# EasyEDA schematic LED SCHEMATIC.json

## Sheets
1 按键矩阵64: TITLE: 按键矩阵64; REV: 1.0; Date: 2023-08-13; Sheet: 1/1; Drawn By: daifresne; Company: Your Company
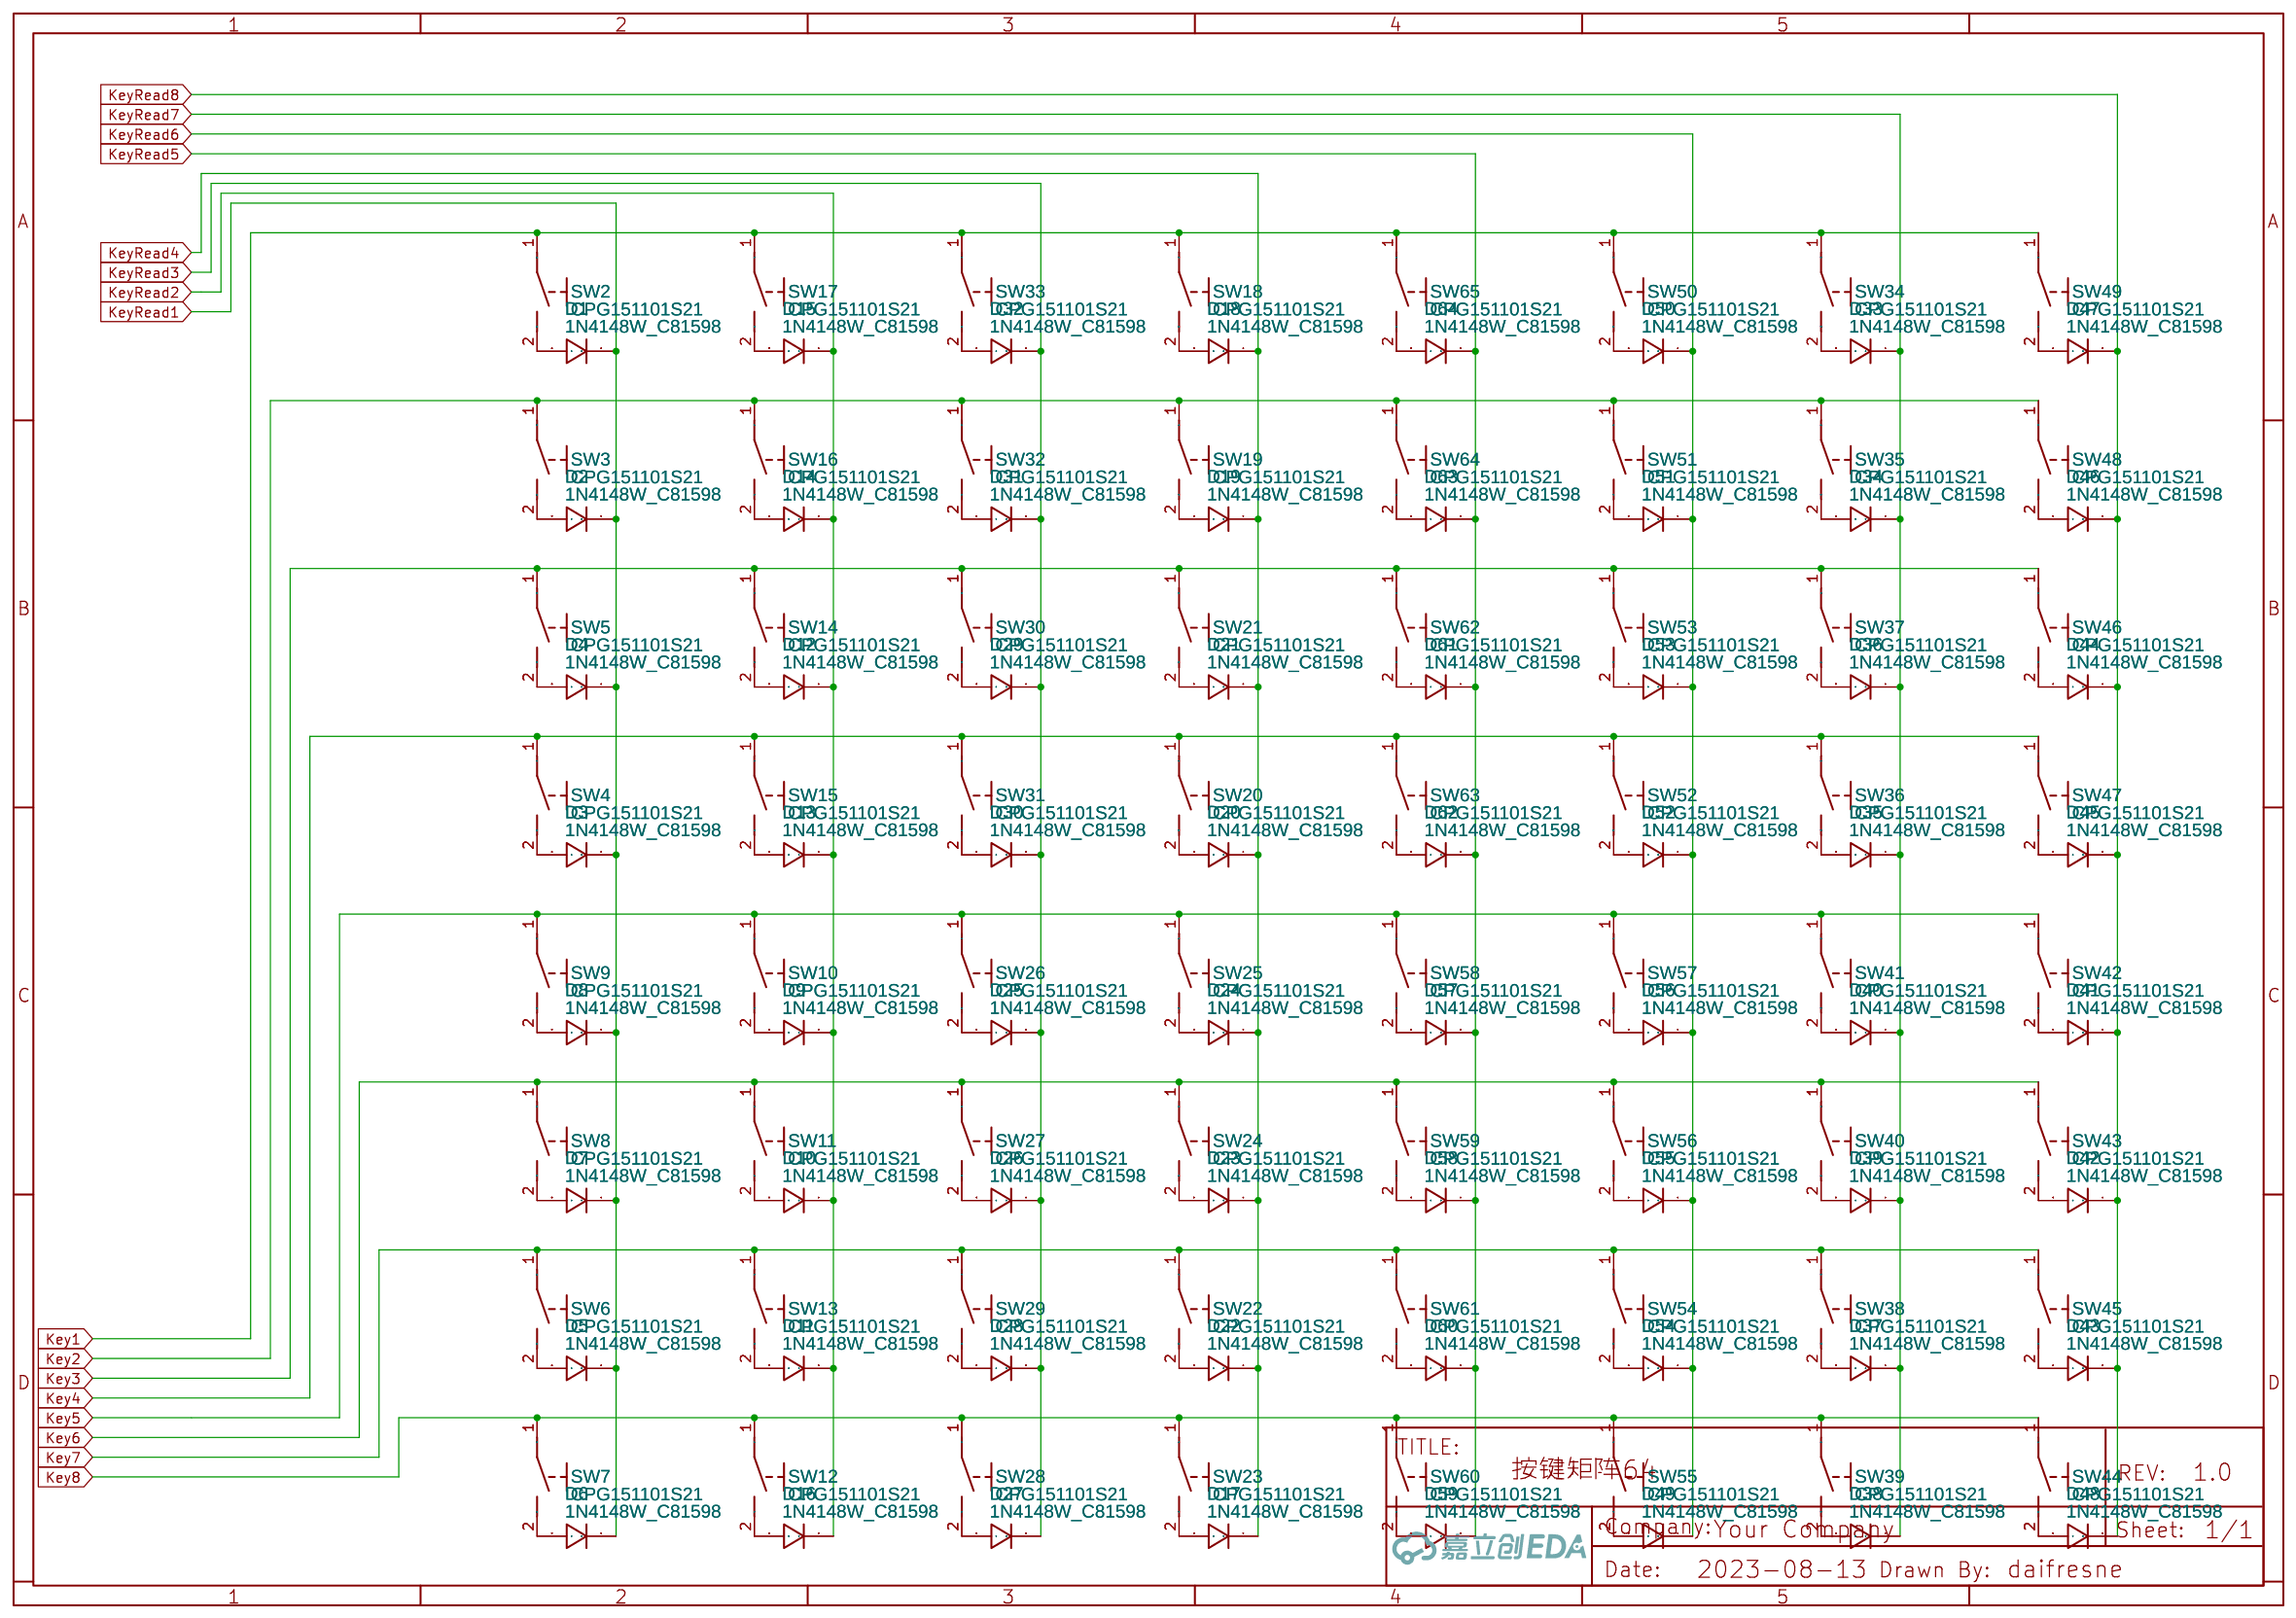
[diagram p0: 按键矩阵64]
2 LED矩阵64: TITLE: LED矩阵64
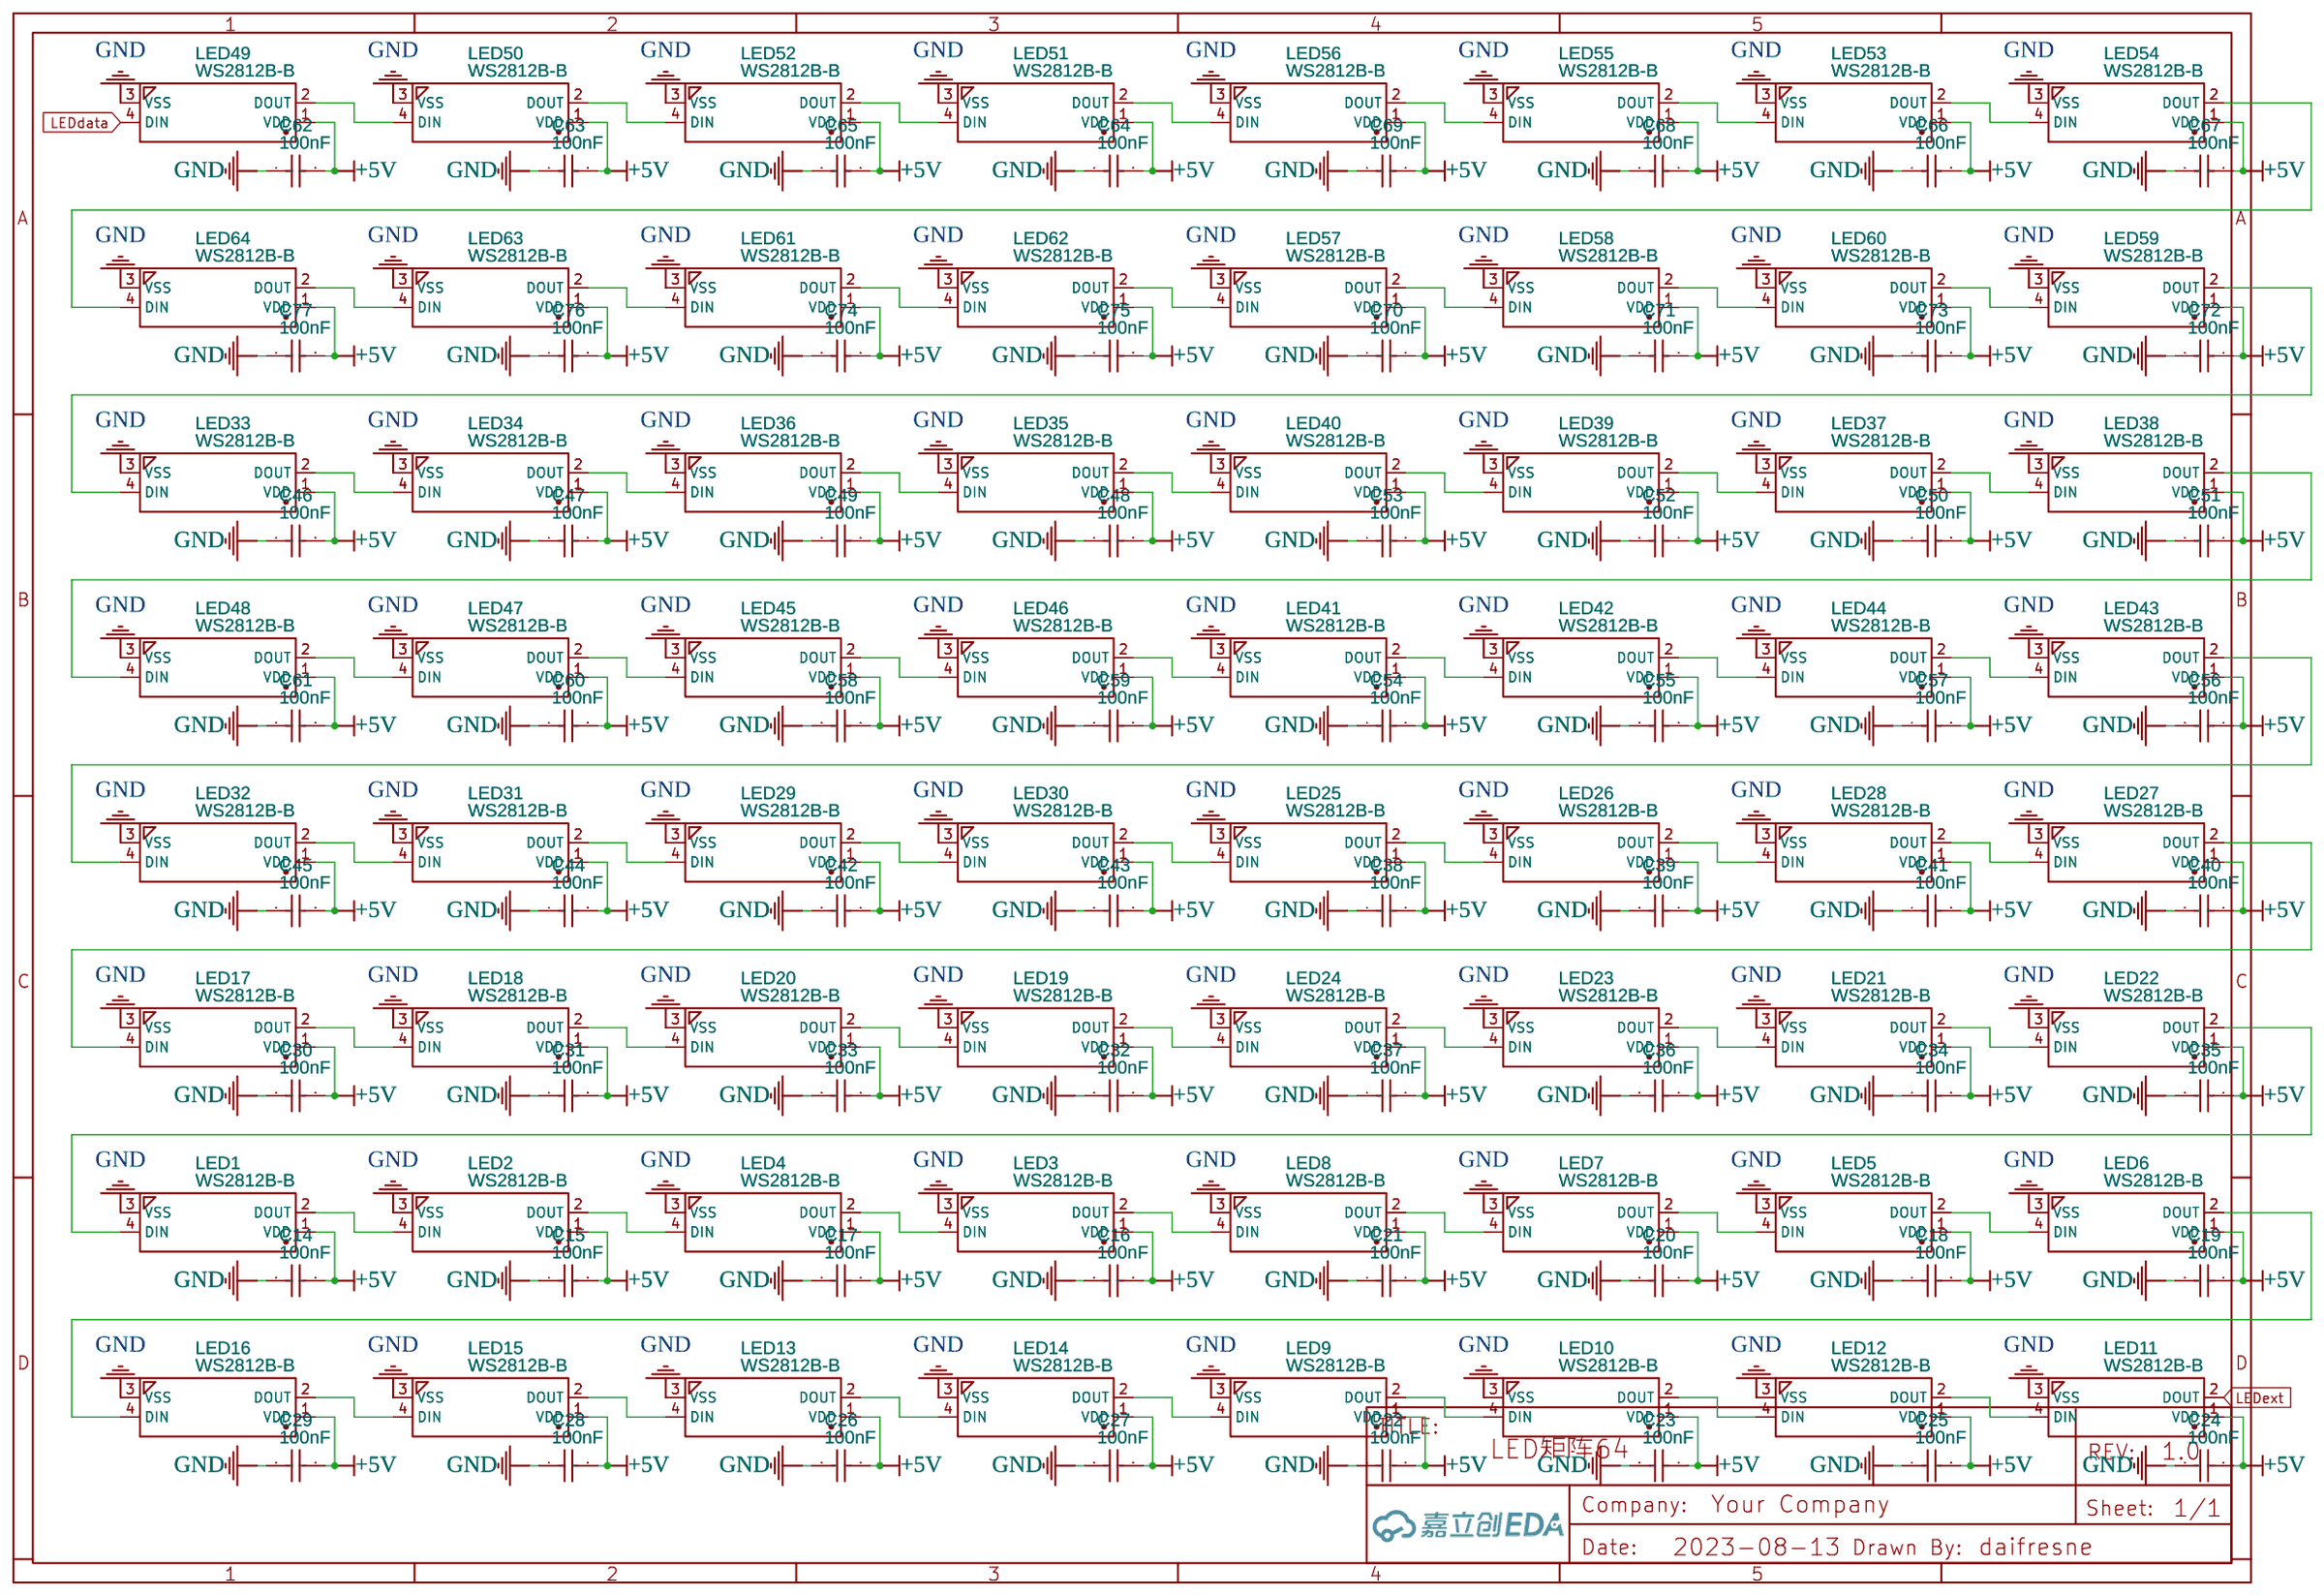
[diagram p1: LED矩阵64]

## Parts
sheet LED矩阵64
C14  100nF  [C0603]
C15  100nF  [C0603]
C16  100nF  [C0603]
C17  100nF  [C0603]
C18  100nF  [C0603]
C19  100nF  [C0603]
C20  100nF  [C0603]
C21  100nF  [C0603]
C22  100nF  [C0603]
C23  100nF  [C0603]
C24  100nF  [C0603]
C25  100nF  [C0603]
C26  100nF  [C0603]
C27  100nF  [C0603]
C28  100nF  [C0603]
C29  100nF  [C0603]
C30  100nF  [C0603]
C31  100nF  [C0603]
C32  100nF  [C0603]
C33  100nF  [C0603]
C34  100nF  [C0603]
C35  100nF  [C0603]
C36  100nF  [C0603]
C37  100nF  [C0603]
C38  100nF  [C0603]
C39  100nF  [C0603]
C40  100nF  [C0603]
C41  100nF  [C0603]
C42  100nF  [C0603]
C43  100nF  [C0603]
C44  100nF  [C0603]
C45  100nF  [C0603]
C46  100nF  [C0603]
C47  100nF  [C0603]
C48  100nF  [C0603]
C49  100nF  [C0603]
C50  100nF  [C0603]
C51  100nF  [C0603]
C52  100nF  [C0603]
C53  100nF  [C0603]
C54  100nF  [C0603]
C55  100nF  [C0603]
C56  100nF  [C0603]
C57  100nF  [C0603]
C58  100nF  [C0603]
C59  100nF  [C0603]
C60  100nF  [C0603]
C61  100nF  [C0603]
C62  100nF  [C0603]
C63  100nF  [C0603]
C64  100nF  [C0603]
C65  100nF  [C0603]
C66  100nF  [C0603]
C67  100nF  [C0603]
C68  100nF  [C0603]
C69  100nF  [C0603]
C70  100nF  [C0603]
C71  100nF  [C0603]
C72  100nF  [C0603]
C73  100nF  [C0603]
C74  100nF  [C0603]
C75  100nF  [C0603]
C76  100nF  [C0603]
C77  100nF  [C0603]
LED1  WS2812B-B  [LED-SMD_4P-L5.0-W5.0-BL_TC5050RGB]
LED2  WS2812B-B  [LED-SMD_4P-L5.0-W5.0-BL_TC5050RGB]
LED3  WS2812B-B  [LED-SMD_4P-L5.0-W5.0-BL_TC5050RGB]
LED4  WS2812B-B  [LED-SMD_4P-L5.0-W5.0-BL_TC5050RGB]
LED5  WS2812B-B  [LED-SMD_4P-L5.0-W5.0-BL_TC5050RGB]
LED6  WS2812B-B  [LED-SMD_4P-L5.0-W5.0-BL_TC5050RGB]
LED7  WS2812B-B  [LED-SMD_4P-L5.0-W5.0-BL_TC5050RGB]
LED8  WS2812B-B  [LED-SMD_4P-L5.0-W5.0-BL_TC5050RGB]
LED9  WS2812B-B  [LED-SMD_4P-L5.0-W5.0-BL_TC5050RGB]
LED10  WS2812B-B  [LED-SMD_4P-L5.0-W5.0-BL_TC5050RGB]
LED11  WS2812B-B  [LED-SMD_4P-L5.0-W5.0-BL_TC5050RGB]
LED12  WS2812B-B  [LED-SMD_4P-L5.0-W5.0-BL_TC5050RGB]
LED13  WS2812B-B  [LED-SMD_4P-L5.0-W5.0-BL_TC5050RGB]
LED14  WS2812B-B  [LED-SMD_4P-L5.0-W5.0-BL_TC5050RGB]
LED15  WS2812B-B  [LED-SMD_4P-L5.0-W5.0-BL_TC5050RGB]
LED16  WS2812B-B  [LED-SMD_4P-L5.0-W5.0-BL_TC5050RGB]
LED17  WS2812B-B  [LED-SMD_4P-L5.0-W5.0-BL_TC5050RGB]
LED18  WS2812B-B  [LED-SMD_4P-L5.0-W5.0-BL_TC5050RGB]
LED19  WS2812B-B  [LED-SMD_4P-L5.0-W5.0-BL_TC5050RGB]
LED20  WS2812B-B  [LED-SMD_4P-L5.0-W5.0-BL_TC5050RGB]
LED21  WS2812B-B  [LED-SMD_4P-L5.0-W5.0-BL_TC5050RGB]
LED22  WS2812B-B  [LED-SMD_4P-L5.0-W5.0-BL_TC5050RGB]
LED23  WS2812B-B  [LED-SMD_4P-L5.0-W5.0-BL_TC5050RGB]
LED24  WS2812B-B  [LED-SMD_4P-L5.0-W5.0-BL_TC5050RGB]
LED25  WS2812B-B  [LED-SMD_4P-L5.0-W5.0-BL_TC5050RGB]
LED26  WS2812B-B  [LED-SMD_4P-L5.0-W5.0-BL_TC5050RGB]
LED27  WS2812B-B  [LED-SMD_4P-L5.0-W5.0-BL_TC5050RGB]
LED28  WS2812B-B  [LED-SMD_4P-L5.0-W5.0-BL_TC5050RGB]
LED29  WS2812B-B  [LED-SMD_4P-L5.0-W5.0-BL_TC5050RGB]
LED30  WS2812B-B  [LED-SMD_4P-L5.0-W5.0-BL_TC5050RGB]
LED31  WS2812B-B  [LED-SMD_4P-L5.0-W5.0-BL_TC5050RGB]
LED32  WS2812B-B  [LED-SMD_4P-L5.0-W5.0-BL_TC5050RGB]
LED33  WS2812B-B  [LED-SMD_4P-L5.0-W5.0-BL_TC5050RGB]
LED34  WS2812B-B  [LED-SMD_4P-L5.0-W5.0-BL_TC5050RGB]
LED35  WS2812B-B  [LED-SMD_4P-L5.0-W5.0-BL_TC5050RGB]
LED36  WS2812B-B  [LED-SMD_4P-L5.0-W5.0-BL_TC5050RGB]
LED37  WS2812B-B  [LED-SMD_4P-L5.0-W5.0-BL_TC5050RGB]
LED38  WS2812B-B  [LED-SMD_4P-L5.0-W5.0-BL_TC5050RGB]
LED39  WS2812B-B  [LED-SMD_4P-L5.0-W5.0-BL_TC5050RGB]
LED40  WS2812B-B  [LED-SMD_4P-L5.0-W5.0-BL_TC5050RGB]
LED41  WS2812B-B  [LED-SMD_4P-L5.0-W5.0-BL_TC5050RGB]
LED42  WS2812B-B  [LED-SMD_4P-L5.0-W5.0-BL_TC5050RGB]
LED43  WS2812B-B  [LED-SMD_4P-L5.0-W5.0-BL_TC5050RGB]
LED44  WS2812B-B  [LED-SMD_4P-L5.0-W5.0-BL_TC5050RGB]
LED45  WS2812B-B  [LED-SMD_4P-L5.0-W5.0-BL_TC5050RGB]
LED46  WS2812B-B  [LED-SMD_4P-L5.0-W5.0-BL_TC5050RGB]
LED47  WS2812B-B  [LED-SMD_4P-L5.0-W5.0-BL_TC5050RGB]
LED48  WS2812B-B  [LED-SMD_4P-L5.0-W5.0-BL_TC5050RGB]
LED49  WS2812B-B  [LED-SMD_4P-L5.0-W5.0-BL_TC5050RGB]
LED50  WS2812B-B  [LED-SMD_4P-L5.0-W5.0-BL_TC5050RGB]
LED51  WS2812B-B  [LED-SMD_4P-L5.0-W5.0-BL_TC5050RGB]
LED52  WS2812B-B  [LED-SMD_4P-L5.0-W5.0-BL_TC5050RGB]
LED53  WS2812B-B  [LED-SMD_4P-L5.0-W5.0-BL_TC5050RGB]
LED54  WS2812B-B  [LED-SMD_4P-L5.0-W5.0-BL_TC5050RGB]
LED55  WS2812B-B  [LED-SMD_4P-L5.0-W5.0-BL_TC5050RGB]
LED56  WS2812B-B  [LED-SMD_4P-L5.0-W5.0-BL_TC5050RGB]
LED57  WS2812B-B  [LED-SMD_4P-L5.0-W5.0-BL_TC5050RGB]
LED58  WS2812B-B  [LED-SMD_4P-L5.0-W5.0-BL_TC5050RGB]
LED59  WS2812B-B  [LED-SMD_4P-L5.0-W5.0-BL_TC5050RGB]
LED60  WS2812B-B  [LED-SMD_4P-L5.0-W5.0-BL_TC5050RGB]
LED61  WS2812B-B  [LED-SMD_4P-L5.0-W5.0-BL_TC5050RGB]
LED62  WS2812B-B  [LED-SMD_4P-L5.0-W5.0-BL_TC5050RGB]
LED63  WS2812B-B  [LED-SMD_4P-L5.0-W5.0-BL_TC5050RGB]
LED64  WS2812B-B  [LED-SMD_4P-L5.0-W5.0-BL_TC5050RGB]
sheet 按键矩阵64
D1  1N4148W_C81598  [SOD-123F_L2.7-W1.6-LS3.8-RD]
D2  1N4148W_C81598  [SOD-123F_L2.7-W1.6-LS3.8-RD]
D3  1N4148W_C81598  [SOD-123F_L2.7-W1.6-LS3.8-RD]
D4  1N4148W_C81598  [SOD-123F_L2.7-W1.6-LS3.8-RD]
D5  1N4148W_C81598  [SOD-123F_L2.7-W1.6-LS3.8-RD]
D6  1N4148W_C81598  [SOD-123F_L2.7-W1.6-LS3.8-RD]
D7  1N4148W_C81598  [SOD-123F_L2.7-W1.6-LS3.8-RD]
D8  1N4148W_C81598  [SOD-123F_L2.7-W1.6-LS3.8-RD]
D9  1N4148W_C81598  [SOD-123F_L2.7-W1.6-LS3.8-RD]
D10  1N4148W_C81598  [SOD-123F_L2.7-W1.6-LS3.8-RD]
D11  1N4148W_C81598  [SOD-123F_L2.7-W1.6-LS3.8-RD]
D12  1N4148W_C81598  [SOD-123F_L2.7-W1.6-LS3.8-RD]
D13  1N4148W_C81598  [SOD-123F_L2.7-W1.6-LS3.8-RD]
D14  1N4148W_C81598  [SOD-123F_L2.7-W1.6-LS3.8-RD]
D15  1N4148W_C81598  [SOD-123F_L2.7-W1.6-LS3.8-RD]
D16  1N4148W_C81598  [SOD-123F_L2.7-W1.6-LS3.8-RD]
D17  1N4148W_C81598  [SOD-123F_L2.7-W1.6-LS3.8-RD]
D18  1N4148W_C81598  [SOD-123F_L2.7-W1.6-LS3.8-RD]
D19  1N4148W_C81598  [SOD-123F_L2.7-W1.6-LS3.8-RD]
D20  1N4148W_C81598  [SOD-123F_L2.7-W1.6-LS3.8-RD]
D21  1N4148W_C81598  [SOD-123F_L2.7-W1.6-LS3.8-RD]
D22  1N4148W_C81598  [SOD-123F_L2.7-W1.6-LS3.8-RD]
D23  1N4148W_C81598  [SOD-123F_L2.7-W1.6-LS3.8-RD]
D24  1N4148W_C81598  [SOD-123F_L2.7-W1.6-LS3.8-RD]
D25  1N4148W_C81598  [SOD-123F_L2.7-W1.6-LS3.8-RD]
D26  1N4148W_C81598  [SOD-123F_L2.7-W1.6-LS3.8-RD]
D27  1N4148W_C81598  [SOD-123F_L2.7-W1.6-LS3.8-RD]
D28  1N4148W_C81598  [SOD-123F_L2.7-W1.6-LS3.8-RD]
D29  1N4148W_C81598  [SOD-123F_L2.7-W1.6-LS3.8-RD]
D30  1N4148W_C81598  [SOD-123F_L2.7-W1.6-LS3.8-RD]
D31  1N4148W_C81598  [SOD-123F_L2.7-W1.6-LS3.8-RD]
D32  1N4148W_C81598  [SOD-123F_L2.7-W1.6-LS3.8-RD]
D33  1N4148W_C81598  [SOD-123F_L2.7-W1.6-LS3.8-RD]
D34  1N4148W_C81598  [SOD-123F_L2.7-W1.6-LS3.8-RD]
D35  1N4148W_C81598  [SOD-123F_L2.7-W1.6-LS3.8-RD]
D36  1N4148W_C81598  [SOD-123F_L2.7-W1.6-LS3.8-RD]
D37  1N4148W_C81598  [SOD-123F_L2.7-W1.6-LS3.8-RD]
D38  1N4148W_C81598  [SOD-123F_L2.7-W1.6-LS3.8-RD]
D39  1N4148W_C81598  [SOD-123F_L2.7-W1.6-LS3.8-RD]
D40  1N4148W_C81598  [SOD-123F_L2.7-W1.6-LS3.8-RD]
D41  1N4148W_C81598  [SOD-123F_L2.7-W1.6-LS3.8-RD]
D42  1N4148W_C81598  [SOD-123F_L2.7-W1.6-LS3.8-RD]
D43  1N4148W_C81598  [SOD-123F_L2.7-W1.6-LS3.8-RD]
D44  1N4148W_C81598  [SOD-123F_L2.7-W1.6-LS3.8-RD]
D45  1N4148W_C81598  [SOD-123F_L2.7-W1.6-LS3.8-RD]
D46  1N4148W_C81598  [SOD-123F_L2.7-W1.6-LS3.8-RD]
D47  1N4148W_C81598  [SOD-123F_L2.7-W1.6-LS3.8-RD]
D48  1N4148W_C81598  [SOD-123F_L2.7-W1.6-LS3.8-RD]
D49  1N4148W_C81598  [SOD-123F_L2.7-W1.6-LS3.8-RD]
D50  1N4148W_C81598  [SOD-123F_L2.7-W1.6-LS3.8-RD]
D51  1N4148W_C81598  [SOD-123F_L2.7-W1.6-LS3.8-RD]
D52  1N4148W_C81598  [SOD-123F_L2.7-W1.6-LS3.8-RD]
D53  1N4148W_C81598  [SOD-123F_L2.7-W1.6-LS3.8-RD]
D54  1N4148W_C81598  [SOD-123F_L2.7-W1.6-LS3.8-RD]
D55  1N4148W_C81598  [SOD-123F_L2.7-W1.6-LS3.8-RD]
D56  1N4148W_C81598  [SOD-123F_L2.7-W1.6-LS3.8-RD]
D57  1N4148W_C81598  [SOD-123F_L2.7-W1.6-LS3.8-RD]
D58  1N4148W_C81598  [SOD-123F_L2.7-W1.6-LS3.8-RD]
D59  1N4148W_C81598  [SOD-123F_L2.7-W1.6-LS3.8-RD]
D60  1N4148W_C81598  [SOD-123F_L2.7-W1.6-LS3.8-RD]
D61  1N4148W_C81598  [SOD-123F_L2.7-W1.6-LS3.8-RD]
D62  1N4148W_C81598  [SOD-123F_L2.7-W1.6-LS3.8-RD]
D63  1N4148W_C81598  [SOD-123F_L2.7-W1.6-LS3.8-RD]
D64  1N4148W_C81598  [SOD-123F_L2.7-W1.6-LS3.8-RD]
SW2  CPG151101S21  [KEY-TH_CPG1511F01S0X]
SW3  CPG151101S21  [KEY-TH_CPG1511F01S0X]
SW4  CPG151101S21  [KEY-TH_CPG1511F01S0X]
SW5  CPG151101S21  [KEY-TH_CPG1511F01S0X]
SW6  CPG151101S21  [KEY-TH_CPG1511F01S0X]
SW7  CPG151101S21  [KEY-TH_CPG1511F01S0X]
SW8  CPG151101S21  [KEY-TH_CPG1511F01S0X]
SW9  CPG151101S21  [KEY-TH_CPG1511F01S0X]
SW10  CPG151101S21  [KEY-TH_CPG1511F01S0X]
SW11  CPG151101S21  [KEY-TH_CPG1511F01S0X]
SW12  CPG151101S21  [KEY-TH_CPG1511F01S0X]
SW13  CPG151101S21  [KEY-TH_CPG1511F01S0X]
SW14  CPG151101S21  [KEY-TH_CPG1511F01S0X]
SW15  CPG151101S21  [KEY-TH_CPG1511F01S0X]
SW16  CPG151101S21  [KEY-TH_CPG1511F01S0X]
SW17  CPG151101S21  [KEY-TH_CPG1511F01S0X]
SW18  CPG151101S21  [KEY-TH_CPG1511F01S0X]
SW19  CPG151101S21  [KEY-TH_CPG1511F01S0X]
SW20  CPG151101S21  [KEY-TH_CPG1511F01S0X]
SW21  CPG151101S21  [KEY-TH_CPG1511F01S0X]
SW22  CPG151101S21  [KEY-TH_CPG1511F01S0X]
SW23  CPG151101S21  [KEY-TH_CPG1511F01S0X]
SW24  CPG151101S21  [KEY-TH_CPG1511F01S0X]
SW25  CPG151101S21  [KEY-TH_CPG1511F01S0X]
SW26  CPG151101S21  [KEY-TH_CPG1511F01S0X]
SW27  CPG151101S21  [KEY-TH_CPG1511F01S0X]
SW28  CPG151101S21  [KEY-TH_CPG1511F01S0X]
SW29  CPG151101S21  [KEY-TH_CPG1511F01S0X]
SW30  CPG151101S21  [KEY-TH_CPG1511F01S0X]
SW31  CPG151101S21  [KEY-TH_CPG1511F01S0X]
SW32  CPG151101S21  [KEY-TH_CPG1511F01S0X]
SW33  CPG151101S21  [KEY-TH_CPG1511F01S0X]
SW34  CPG151101S21  [KEY-TH_CPG1511F01S0X]
SW35  CPG151101S21  [KEY-TH_CPG1511F01S0X]
SW36  CPG151101S21  [KEY-TH_CPG1511F01S0X]
SW37  CPG151101S21  [KEY-TH_CPG1511F01S0X]
SW38  CPG151101S21  [KEY-TH_CPG1511F01S0X]
SW39  CPG151101S21  [KEY-TH_CPG1511F01S0X]
SW40  CPG151101S21  [KEY-TH_CPG1511F01S0X]
SW41  CPG151101S21  [KEY-TH_CPG1511F01S0X]
SW42  CPG151101S21  [KEY-TH_CPG1511F01S0X]
SW43  CPG151101S21  [KEY-TH_CPG1511F01S0X]
SW44  CPG151101S21  [KEY-TH_CPG1511F01S0X]
SW45  CPG151101S21  [KEY-TH_CPG1511F01S0X]
SW46  CPG151101S21  [KEY-TH_CPG1511F01S0X]
SW47  CPG151101S21  [KEY-TH_CPG1511F01S0X]
SW48  CPG151101S21  [KEY-TH_CPG1511F01S0X]
SW49  CPG151101S21  [KEY-TH_CPG1511F01S0X]
SW50  CPG151101S21  [KEY-TH_CPG1511F01S0X]
SW51  CPG151101S21  [KEY-TH_CPG1511F01S0X]
SW52  CPG151101S21  [KEY-TH_CPG1511F01S0X]
SW53  CPG151101S21  [KEY-TH_CPG1511F01S0X]
SW54  CPG151101S21  [KEY-TH_CPG1511F01S0X]
SW55  CPG151101S21  [KEY-TH_CPG1511F01S0X]
SW56  CPG151101S21  [KEY-TH_CPG1511F01S0X]
SW57  CPG151101S21  [KEY-TH_CPG1511F01S0X]
SW58  CPG151101S21  [KEY-TH_CPG1511F01S0X]
SW59  CPG151101S21  [KEY-TH_CPG1511F01S0X]
SW60  CPG151101S21  [KEY-TH_CPG1511F01S0X]
SW61  CPG151101S21  [KEY-TH_CPG1511F01S0X]
SW62  CPG151101S21  [KEY-TH_CPG1511F01S0X]
SW63  CPG151101S21  [KEY-TH_CPG1511F01S0X]
SW64  CPG151101S21  [KEY-TH_CPG1511F01S0X]
SW65  CPG151101S21  [KEY-TH_CPG1511F01S0X]

## Library data of the parts
C14-C77 = CC0603KRX7R8BB104: Supplier: LCSC; Manufacturer: YAGEO(国巨); Supplier Part: C92490; JLCPCB Part Class: Extended Part
LED1-LED64 = WS2812B-B: Contributor: LCSC; Supplier: LCSC; Manufacturer: worldsemi; Supplier Part: C114586; JLCPCB Part Class: Extended Part
D1-D64 = 1N4148W_C81598: Supplier: LCSC; Manufacturer: ST(先科); Supplier Part: C81598; JLCPCB Part Class: Basic Part
SW2-SW65 = CPG151101S21: Contributor: LCSC; Supplier: LCSC; Supplier Part: C404351; Manufacturer: Kailh(凯华); JLCPCB Part Class: Extended Part

## Nets
+5V: C14.2 C15.2 C16.2 C17.2 C18.2 C19.2 C20.2 C21.2 C22.2 C23.2 C24.2 C25.2 C26.2 C27.2 C28.2 C29.2 C30.2 C31.2 C32.2 C33.2 C34.2 C35.2 C36.2 C37.2 C38.2 C39.2 C40.2 C41.2 C42.2 C43.2 C44.2 C45.2 C46.2 C47.2 C48.2 C49.2 C50.2 C51.2 C52.2 C53.2 C54.2 C55.2 C56.2 C57.2 C58.2 C59.2 C60.2 C61.2 C62.2 C63.2 C64.2 C65.2 C66.2 C67.2 C68.2 C69.2 C70.2 C71.2 C72.2 C73.2 C74.2 C75.2 C76.2 C77.2 LED1.1(VDD) LED2.1(VDD) LED3.1(VDD) LED4.1(VDD) LED5.1(VDD) LED6.1(VDD) LED7.1(VDD) LED8.1(VDD) LED9.1(VDD) LED10.1(VDD) LED11.1(VDD) LED12.1(VDD) LED13.1(VDD) LED14.1(VDD) LED15.1(VDD) LED16.1(VDD) LED17.1(VDD) LED18.1(VDD) LED19.1(VDD) LED20.1(VDD) LED21.1(VDD) LED22.1(VDD) LED23.1(VDD) LED24.1(VDD) LED25.1(VDD) LED26.1(VDD) LED27.1(VDD) LED28.1(VDD) LED29.1(VDD) LED30.1(VDD) LED31.1(VDD) LED32.1(VDD) LED33.1(VDD) LED34.1(VDD) LED35.1(VDD) LED36.1(VDD) LED37.1(VDD) LED38.1(VDD) LED39.1(VDD) LED40.1(VDD) LED41.1(VDD) LED42.1(VDD) LED43.1(VDD) LED44.1(VDD) LED45.1(VDD) LED46.1(VDD) LED47.1(VDD) LED48.1(VDD) LED49.1(VDD) LED50.1(VDD) LED51.1(VDD) LED52.1(VDD) LED53.1(VDD) LED54.1(VDD) LED55.1(VDD) LED56.1(VDD) LED57.1(VDD) LED58.1(VDD) LED59.1(VDD) LED60.1(VDD) LED61.1(VDD) LED62.1(VDD) LED63.1(VDD) LED64.1(VDD)
GND: C14.1 C15.1 C16.1 C17.1 C18.1 C19.1 C20.1 C21.1 C22.1 C23.1 C24.1 C25.1 C26.1 C27.1 C28.1 C29.1 C30.1 C31.1 C32.1 C33.1 C34.1 C35.1 C36.1 C37.1 C38.1 C39.1 C40.1 C41.1 C42.1 C43.1 C44.1 C45.1 C46.1 C47.1 C48.1 C49.1 C50.1 C51.1 C52.1 C53.1 C54.1 C55.1 C56.1 C57.1 C58.1 C59.1 C60.1 C61.1 C62.1 C63.1 C64.1 C65.1 C66.1 C67.1 C68.1 C69.1 C70.1 C71.1 C72.1 C73.1 C74.1 C75.1 C76.1 C77.1 LED1.3(VSS) LED2.3(VSS) LED3.3(VSS) LED4.3(VSS) LED5.3(VSS) LED6.3(VSS) LED7.3(VSS) LED8.3(VSS) LED9.3(VSS) LED10.3(VSS) LED11.3(VSS) LED12.3(VSS) LED13.3(VSS) LED14.3(VSS) LED15.3(VSS) LED16.3(VSS) LED17.3(VSS) LED18.3(VSS) LED19.3(VSS) LED20.3(VSS) LED21.3(VSS) LED22.3(VSS) LED23.3(VSS) LED24.3(VSS) LED25.3(VSS) LED26.3(VSS) LED27.3(VSS) LED28.3(VSS) LED29.3(VSS) LED30.3(VSS) LED31.3(VSS) LED32.3(VSS) LED33.3(VSS) LED34.3(VSS) LED35.3(VSS) LED36.3(VSS) LED37.3(VSS) LED38.3(VSS) LED39.3(VSS) LED40.3(VSS) LED41.3(VSS) LED42.3(VSS) LED43.3(VSS) LED44.3(VSS) LED45.3(VSS) LED46.3(VSS) LED47.3(VSS) LED48.3(VSS) LED49.3(VSS) LED50.3(VSS) LED51.3(VSS) LED52.3(VSS) LED53.3(VSS) LED54.3(VSS) LED55.3(VSS) LED56.3(VSS) LED57.3(VSS) LED58.3(VSS) LED59.3(VSS) LED60.3(VSS) LED61.3(VSS) LED62.3(VSS) LED63.3(VSS) LED64.3(VSS)
Key1: SW2.1 SW17.1 SW18.1 SW33.1 SW34.1 SW49.1 SW50.1 SW65.1
Key2: SW3.1 SW16.1 SW19.1 SW32.1 SW35.1 SW48.1 SW51.1 SW64.1
Key3: SW5.1 SW14.1 SW21.1 SW30.1 SW37.1 SW46.1 SW53.1 SW62.1
Key4: SW4.1 SW15.1 SW20.1 SW31.1 SW36.1 SW47.1 SW52.1 SW63.1
Key5: SW9.1 SW10.1 SW25.1 SW26.1 SW41.1 SW42.1 SW57.1 SW58.1
Key6: SW8.1 SW11.1 SW24.1 SW27.1 SW40.1 SW43.1 SW56.1 SW59.1
Key7: SW6.1 SW13.1 SW22.1 SW29.1 SW38.1 SW45.1 SW54.1 SW61.1
Key8: SW7.1 SW12.1 SW23.1 SW28.1 SW39.1 SW44.1 SW55.1 SW60.1
KeyRead1: D1.1(K) D2.1(K) D3.1(K) D4.1(K) D5.1(K) D6.1(K) D7.1(K) D8.1(K)
KeyRead2: D9.1(K) D10.1(K) D11.1(K) D12.1(K) D13.1(K) D14.1(K) D15.1(K) D16.1(K)
KeyRead3: D25.1(K) D26.1(K) D27.1(K) D28.1(K) D29.1(K) D30.1(K) D31.1(K) D32.1(K)
KeyRead4: D17.1(K) D18.1(K) D19.1(K) D20.1(K) D21.1(K) D22.1(K) D23.1(K) D24.1(K)
KeyRead5: D57.1(K) D58.1(K) D59.1(K) D60.1(K) D61.1(K) D62.1(K) D63.1(K) D64.1(K)
KeyRead6: D49.1(K) D50.1(K) D51.1(K) D52.1(K) D53.1(K) D54.1(K) D55.1(K) D56.1(K)
KeyRead7: D33.1(K) D34.1(K) D35.1(K) D36.1(K) D37.1(K) D38.1(K) D39.1(K) D40.1(K)
KeyRead8: D41.1(K) D42.1(K) D43.1(K) D44.1(K) D45.1(K) D46.1(K) D47.1(K) D48.1(K)
LEDdata: LED49.4(DIN)
LEDext: LED11.2(DOUT)
Net-(D1-2): D1.2(A) SW2.2
Net-(D2-2): D2.2(A) SW3.2
Net-(D3-2): D3.2(A) SW4.2
Net-(D4-2): D4.2(A) SW5.2
Net-(D5-2): D5.2(A) SW6.2
Net-(D6-2): D6.2(A) SW7.2
Net-(D7-2): D7.2(A) SW8.2
Net-(D8-2): D8.2(A) SW9.2
Net-(D9-2): D9.2(A) SW10.2
Net-(D10-2): D10.2(A) SW11.2
Net-(D11-2): D11.2(A) SW13.2
Net-(D12-2): D12.2(A) SW14.2
Net-(D13-2): D13.2(A) SW15.2
Net-(D14-2): D14.2(A) SW16.2
Net-(D15-2): D15.2(A) SW17.2
Net-(D16-2): D16.2(A) SW12.2
Net-(D17-2): D17.2(A) SW23.2
Net-(D18-2): D18.2(A) SW18.2
Net-(D19-2): D19.2(A) SW19.2
Net-(D20-2): D20.2(A) SW20.2
Net-(D21-2): D21.2(A) SW21.2
Net-(D22-2): D22.2(A) SW22.2
Net-(D23-2): D23.2(A) SW24.2
Net-(D24-2): D24.2(A) SW25.2
Net-(D25-2): D25.2(A) SW26.2
Net-(D26-2): D26.2(A) SW27.2
Net-(D27-2): D27.2(A) SW28.2
Net-(D28-2): D28.2(A) SW29.2
Net-(D29-2): D29.2(A) SW30.2
Net-(D30-2): D30.2(A) SW31.2
Net-(D31-2): D31.2(A) SW32.2
Net-(D32-2): D32.2(A) SW33.2
Net-(D33-2): D33.2(A) SW34.2
Net-(D34-2): D34.2(A) SW35.2
Net-(D35-2): D35.2(A) SW36.2
Net-(D36-2): D36.2(A) SW37.2
Net-(D37-2): D37.2(A) SW38.2
Net-(D38-2): D38.2(A) SW39.2
Net-(D39-2): D39.2(A) SW40.2
Net-(D40-2): D40.2(A) SW41.2
Net-(D41-2): D41.2(A) SW42.2
Net-(D42-2): D42.2(A) SW43.2
Net-(D43-2): D43.2(A) SW45.2
Net-(D44-2): D44.2(A) SW46.2
Net-(D45-2): D45.2(A) SW47.2
Net-(D46-2): D46.2(A) SW48.2
Net-(D47-2): D47.2(A) SW49.2
Net-(D48-2): D48.2(A) SW44.2
Net-(D49-2): D49.2(A) SW55.2
Net-(D50-2): D50.2(A) SW50.2
Net-(D51-2): D51.2(A) SW51.2
Net-(D52-2): D52.2(A) SW52.2
Net-(D53-2): D53.2(A) SW53.2
Net-(D54-2): D54.2(A) SW54.2
Net-(D55-2): D55.2(A) SW56.2
Net-(D56-2): D56.2(A) SW57.2
Net-(D57-2): D57.2(A) SW58.2
Net-(D58-2): D58.2(A) SW59.2
Net-(D59-2): D59.2(A) SW60.2
Net-(D60-2): D60.2(A) SW61.2
Net-(D61-2): D61.2(A) SW62.2
Net-(D62-2): D62.2(A) SW63.2
Net-(D63-2): D63.2(A) SW64.2
Net-(D64-2): D64.2(A) SW65.2
Net-(LED1-2): LED1.2(DOUT) LED2.4(DIN)
Net-(LED1-4): LED1.4(DIN) LED22.2(DOUT)
Net-(LED2-2): LED2.2(DOUT) LED4.4(DIN)
Net-(LED3-2): LED3.2(DOUT) LED8.4(DIN)
Net-(LED3-4): LED3.4(DIN) LED4.2(DOUT)
Net-(LED5-2): LED5.2(DOUT) LED6.4(DIN)
Net-(LED5-4): LED5.4(DIN) LED7.2(DOUT)
Net-(LED6-2): LED6.2(DOUT) LED16.4(DIN)
Net-(LED7-4): LED7.4(DIN) LED8.2(DOUT)
Net-(LED9-2): LED9.2(DOUT) LED10.4(DIN)
Net-(LED9-4): LED9.4(DIN) LED14.2(DOUT)
Net-(LED10-2): LED10.2(DOUT) LED12.4(DIN)
Net-(LED11-4): LED11.4(DIN) LED12.2(DOUT)
Net-(LED13-2): LED13.2(DOUT) LED14.4(DIN)
Net-(LED13-4): LED13.4(DIN) LED15.2(DOUT)
Net-(LED15-4): LED15.4(DIN) LED16.2(DOUT)
Net-(LED17-2): LED17.2(DOUT) LED18.4(DIN)
Net-(LED17-4): LED17.4(DIN) LED27.2(DOUT)
Net-(LED18-2): LED18.2(DOUT) LED20.4(DIN)
Net-(LED19-2): LED19.2(DOUT) LED24.4(DIN)
Net-(LED19-4): LED19.4(DIN) LED20.2(DOUT)
Net-(LED21-2): LED21.2(DOUT) LED22.4(DIN)
Net-(LED21-4): LED21.4(DIN) LED23.2(DOUT)
Net-(LED23-4): LED23.4(DIN) LED24.2(DOUT)
Net-(LED25-2): LED25.2(DOUT) LED26.4(DIN)
Net-(LED25-4): LED25.4(DIN) LED30.2(DOUT)
Net-(LED26-2): LED26.2(DOUT) LED28.4(DIN)
Net-(LED27-4): LED27.4(DIN) LED28.2(DOUT)
Net-(LED29-2): LED29.2(DOUT) LED30.4(DIN)
Net-(LED29-4): LED29.4(DIN) LED31.2(DOUT)
Net-(LED31-4): LED31.4(DIN) LED32.2(DOUT)
Net-(LED32-4): LED32.4(DIN) LED43.2(DOUT)
Net-(LED33-2): LED33.2(DOUT) LED34.4(DIN)
Net-(LED33-4): LED33.4(DIN) LED59.2(DOUT)
Net-(LED34-2): LED34.2(DOUT) LED36.4(DIN)
Net-(LED35-2): LED35.2(DOUT) LED40.4(DIN)
Net-(LED35-4): LED35.4(DIN) LED36.2(DOUT)
Net-(LED37-2): LED37.2(DOUT) LED38.4(DIN)
Net-(LED37-4): LED37.4(DIN) LED39.2(DOUT)
Net-(LED38-2): LED38.2(DOUT) LED48.4(DIN)
Net-(LED39-4): LED39.4(DIN) LED40.2(DOUT)
Net-(LED41-2): LED41.2(DOUT) LED42.4(DIN)
Net-(LED41-4): LED41.4(DIN) LED46.2(DOUT)
Net-(LED42-2): LED42.2(DOUT) LED44.4(DIN)
Net-(LED43-4): LED43.4(DIN) LED44.2(DOUT)
Net-(LED45-2): LED45.2(DOUT) LED46.4(DIN)
Net-(LED45-4): LED45.4(DIN) LED47.2(DOUT)
Net-(LED47-4): LED47.4(DIN) LED48.2(DOUT)
Net-(LED49-2): LED49.2(DOUT) LED50.4(DIN)
Net-(LED50-2): LED50.2(DOUT) LED52.4(DIN)
Net-(LED51-2): LED51.2(DOUT) LED56.4(DIN)
Net-(LED51-4): LED51.4(DIN) LED52.2(DOUT)
Net-(LED53-2): LED53.2(DOUT) LED54.4(DIN)
Net-(LED53-4): LED53.4(DIN) LED55.2(DOUT)
Net-(LED54-2): LED54.2(DOUT) LED64.4(DIN)
Net-(LED55-4): LED55.4(DIN) LED56.2(DOUT)
Net-(LED57-2): LED57.2(DOUT) LED58.4(DIN)
Net-(LED57-4): LED57.4(DIN) LED62.2(DOUT)
Net-(LED58-2): LED58.2(DOUT) LED60.4(DIN)
Net-(LED59-4): LED59.4(DIN) LED60.2(DOUT)
Net-(LED61-2): LED61.2(DOUT) LED62.4(DIN)
Net-(LED61-4): LED61.4(DIN) LED63.2(DOUT)
Net-(LED63-4): LED63.4(DIN) LED64.2(DOUT)
